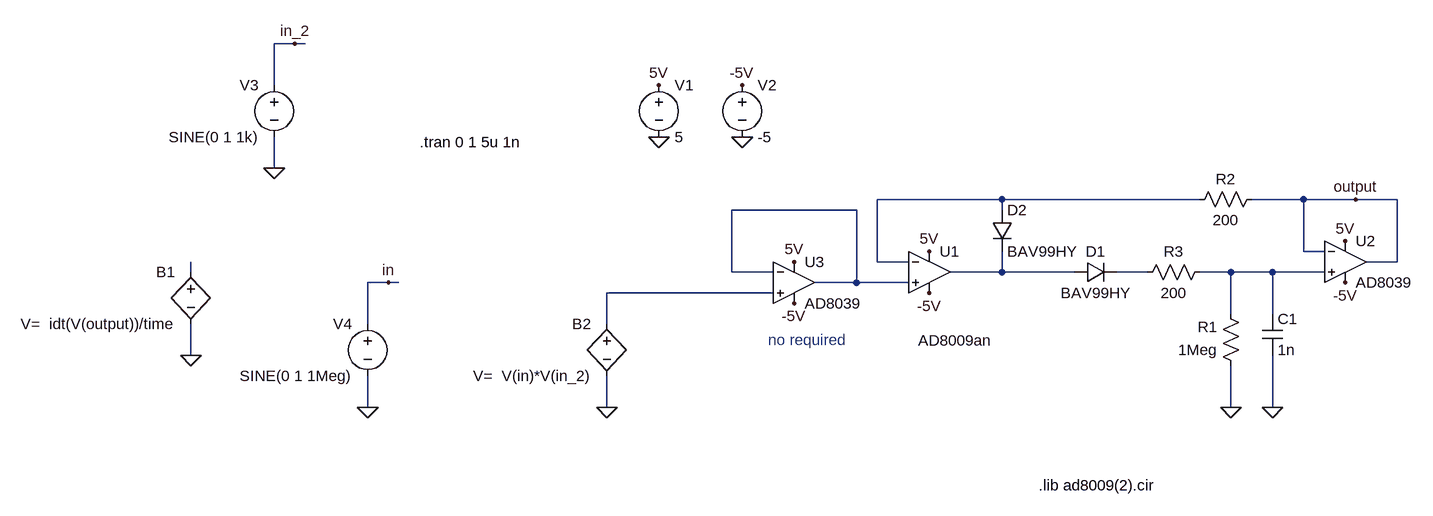
[diagram p0: schematic great_simple_available.asc]
great_simple_available.asc, the LTspice schematic file:
Version 4
SHEET 1 1476 680
WIRE -400 -80 -432 -80
WIRE -384 -80 -400 -80
WIRE -432 -16 -432 -80
WIRE -432 112 -432 64
WIRE 688 160 496 160
WIRE 992 160 688 160
WIRE 1152 160 1072 160
WIRE 1232 160 1152 160
WIRE 1296 160 1232 160
WIRE 464 176 272 176
WIRE 688 176 688 160
WIRE 1152 240 1152 160
WIRE 1184 240 1152 240
WIRE 496 256 496 160
WIRE 544 256 496 256
WIRE 1296 256 1296 160
WIRE 1296 256 1248 256
WIRE -560 272 -560 256
WIRE 272 272 272 176
WIRE 336 272 272 272
WIRE 688 272 688 240
WIRE 688 272 608 272
WIRE 800 272 688 272
WIRE 912 272 864 272
WIRE 1040 272 992 272
WIRE 1104 272 1040 272
WIRE 1184 272 1104 272
WIRE -256 288 -288 288
WIRE -240 288 -256 288
WIRE 464 288 464 176
WIRE 464 288 400 288
WIRE 544 288 464 288
WIRE 336 304 80 304
WIRE 1040 336 1040 272
WIRE 1104 336 1104 272
WIRE -288 352 -288 288
WIRE 80 352 80 304
WIRE -560 400 -560 352
WIRE -288 480 -288 432
WIRE 80 480 80 432
WIRE 1040 480 1040 416
WIRE 1104 480 1104 400
FLAG 160 64 0
FLAG 576 240 5V
FLAG 160 -16 5V
FLAG 288 64 0
FLAG 288 -16 -5V
FLAG 576 304 -5V
FLAG 1040 480 0
FLAG 1104 480 0
FLAG 80 480 0
FLAG 1216 224 5V
FLAG 1216 288 -5V
FLAG -560 400 0
FLAG 1232 160 output
FLAG -288 480 0
FLAG -256 288 in
FLAG -432 112 0
FLAG -400 -80 in_2
FLAG 368 256 5V
FLAG 368 320 -5V
SYMBOL OpAmps\\opamp2 576 208 R0
WINDOW 3 -17 169 Left 2
SYMATTR Value AD8009an
SYMATTR InstName U1
SYMBOL voltage 160 -32 R0
WINDOW 123 0 0 Left 0
WINDOW 39 0 0 Left 0
SYMATTR InstName V1
SYMATTR Value 5
SYMBOL voltage 288 -32 R0
WINDOW 123 0 0 Left 0
WINDOW 39 0 0 Left 0
SYMATTR InstName V2
SYMATTR Value -5
SYMBOL diode 800 288 R270
WINDOW 0 32 32 VTop 2
WINDOW 3 0 32 VBottom 2
SYMATTR InstName D1
SYMATTR Value BAV99HY
SYMBOL res 1056 432 R180
WINDOW 0 36 76 Left 2
WINDOW 3 36 40 Left 2
SYMATTR InstName R1
SYMATTR Value 1Meg
SYMBOL cap 1088 336 R0
SYMATTR InstName C1
SYMATTR Value 1n
SYMBOL res 1088 144 R90
WINDOW 0 0 56 VBottom 2
WINDOW 3 32 56 VTop 2
SYMATTR InstName R2
SYMATTR Value 200
SYMBOL diode 672 176 R0
SYMATTR InstName D2
SYMATTR Value BAV99HY
SYMBOL res 1008 256 R90
WINDOW 0 0 56 VBottom 2
WINDOW 3 32 56 VTop 2
SYMATTR InstName R3
SYMATTR Value 200
SYMBOL bv -560 256 M0
SYMATTR InstName B1
SYMATTR Value V=  idt(V(output))/time
SYMBOL OpAmps\\AD8039 1216 192 R0
SYMATTR InstName U2
SYMBOL voltage -288 336 M0
WINDOW 123 0 0 Left 0
WINDOW 39 0 0 Left 0
SYMATTR InstName V4
SYMATTR Value SINE(0 1 1Meg)
SYMBOL bv 80 336 M0
SYMATTR InstName B2
SYMATTR Value V=  V(in)*V(in_2)
SYMBOL voltage -432 -32 M0
WINDOW 123 0 0 Left 0
WINDOW 39 0 0 Left 0
SYMATTR InstName V3
SYMATTR Value SINE(0 1 1k)
SYMBOL OpAmps\\AD8039 368 224 R0
SYMATTR InstName U3
TEXT -208 72 Left 2 !.tran 0 1 5u 1n
TEXT 744 600 Left 2 !.lib ad8009(2).cir
TEXT 328 376 Left 2 ;no required

The netlist it stands for:
* great_simple_available.asc
XU1 N002 N001 5V -5V N004 AD8009an  ; pins In+ In- V+ V- OUT
V1 5V 0 5
V2 -5V 0 -5
D1 N004 N005 BAV99HY
R1 0 N006 1Meg
C1 N006 0 1n
R2 output N001 200
D2 N001 N004 BAV99HY
R3 N006 N005 200
B1 N003 0 V=  idt(V(output))/time
XU2 N006 output 5V -5V output AD8039  ; pins In+ In- V+ V- OUT
V4 in 0 SINE(0 1 1Meg)
B2 N007 0 V=  V(in)*V(in_2)
V3 in_2 0 SINE(0 1 1k)
XU3 N007 N002 5V -5V N002 AD8039  ; pins In+ In- V+ V- OUT
.model D D
.lib standard.dio
.tran 0 1 5u 1n
.lib ad8009(2).cir
* no required
.backanno
.end